# EAGLE schematic TPadTabletBattery (EAGLE 6.3)
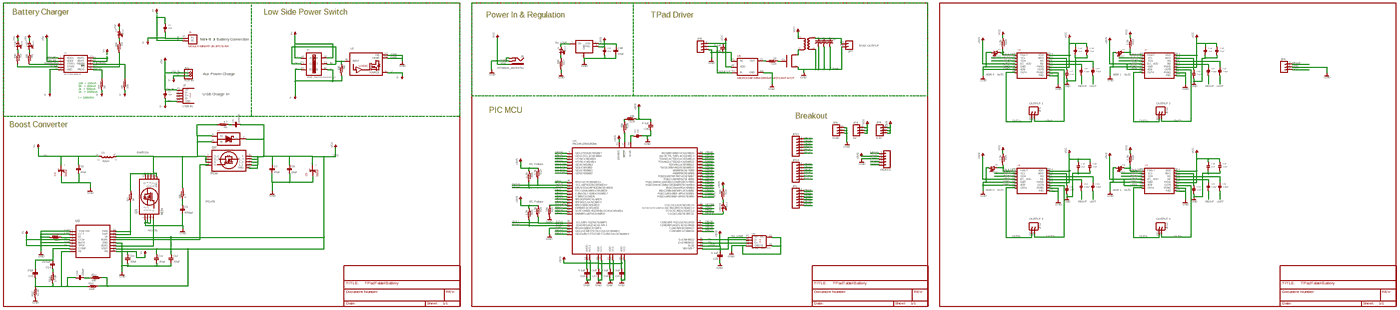
[diagram p0: schematic, sheet 1, overview]
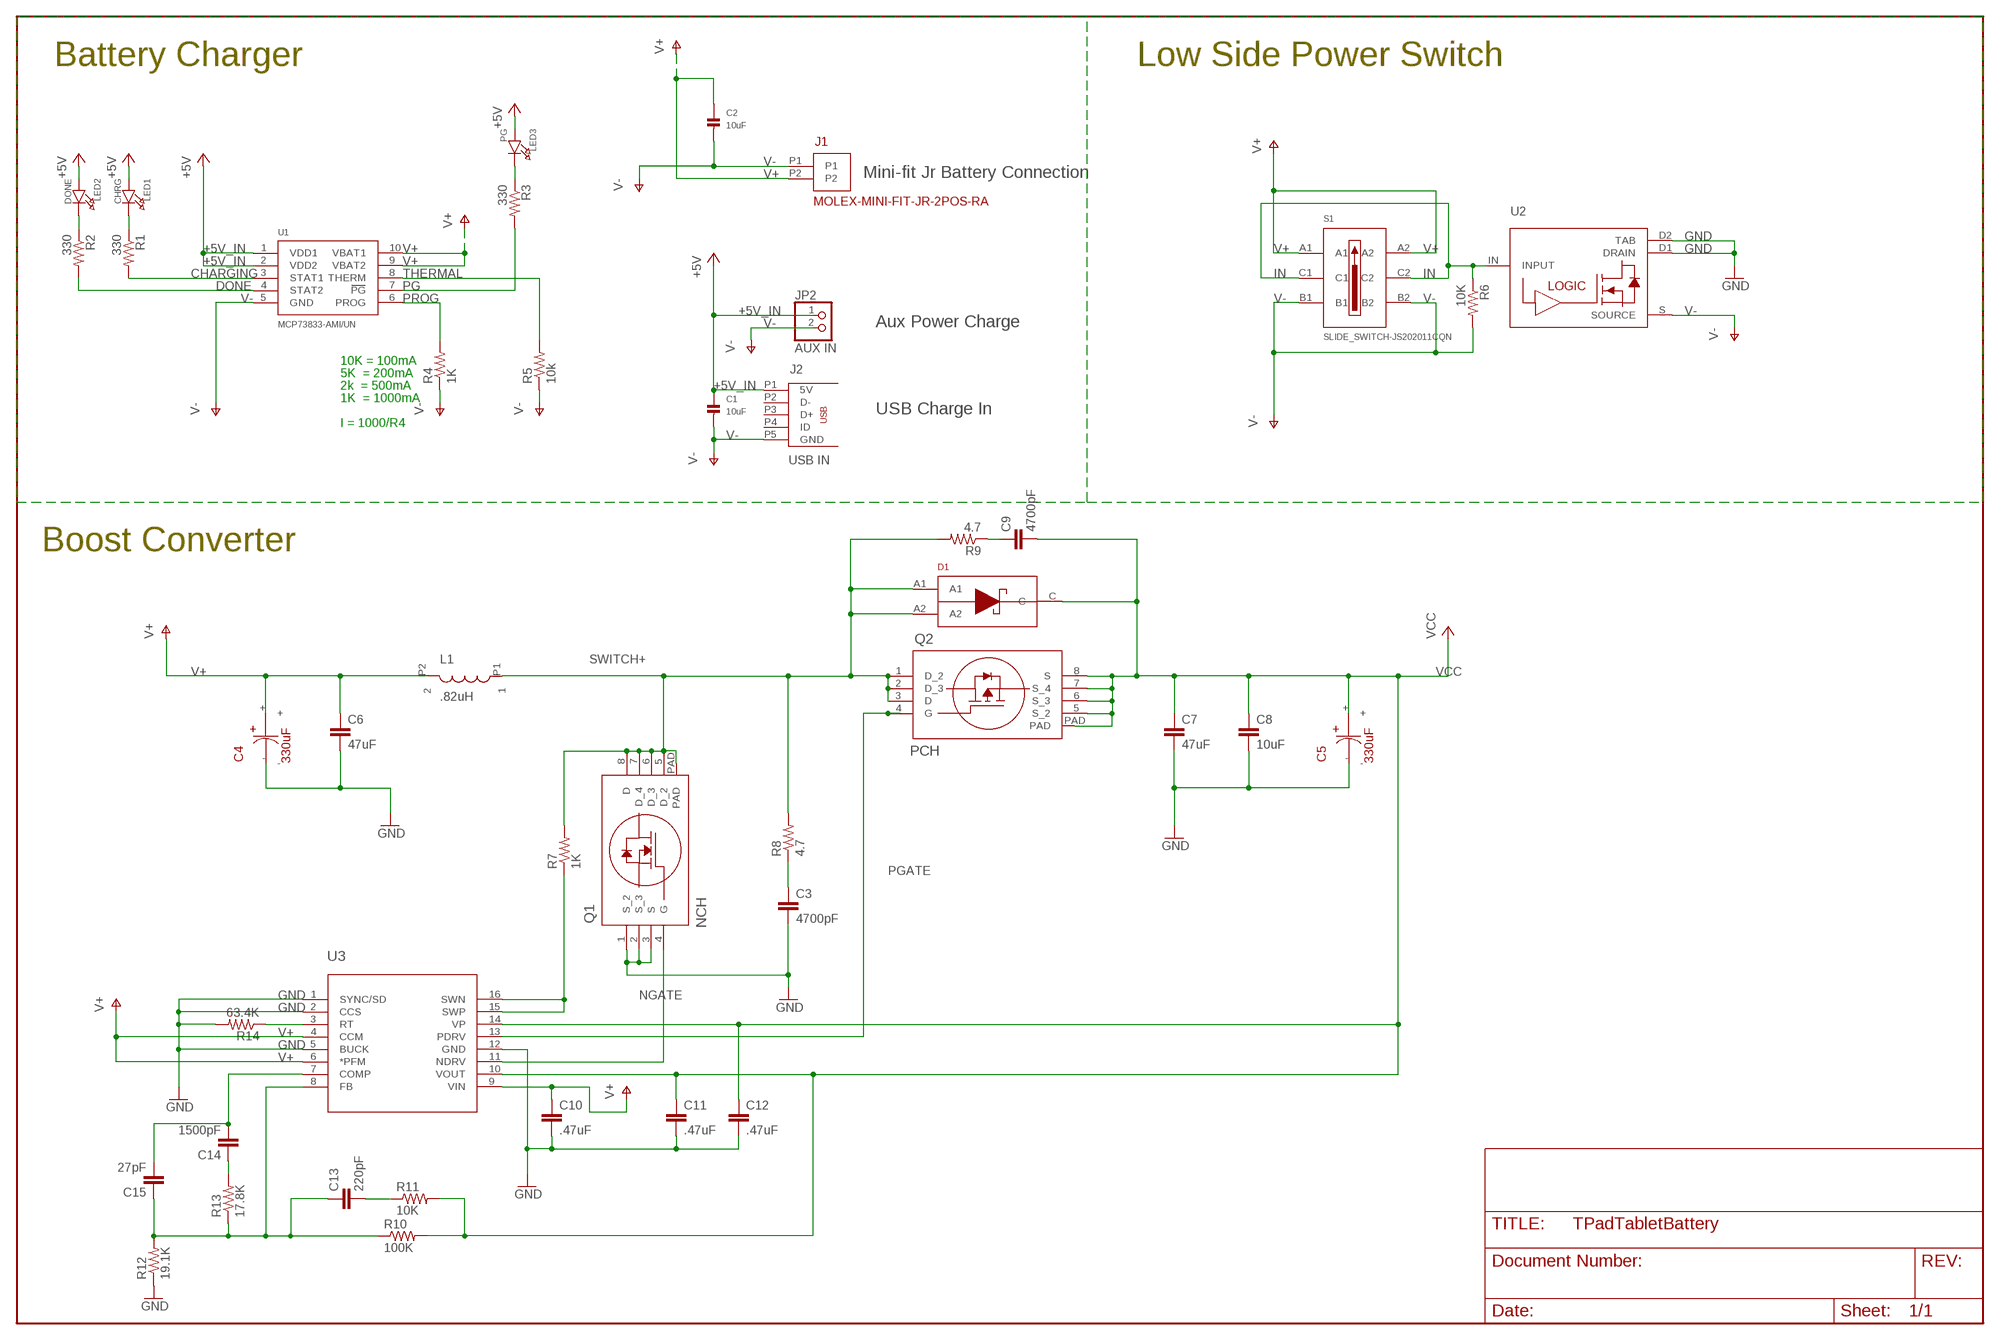
[diagram p1: schematic, sheet 1, part 1 of 4]
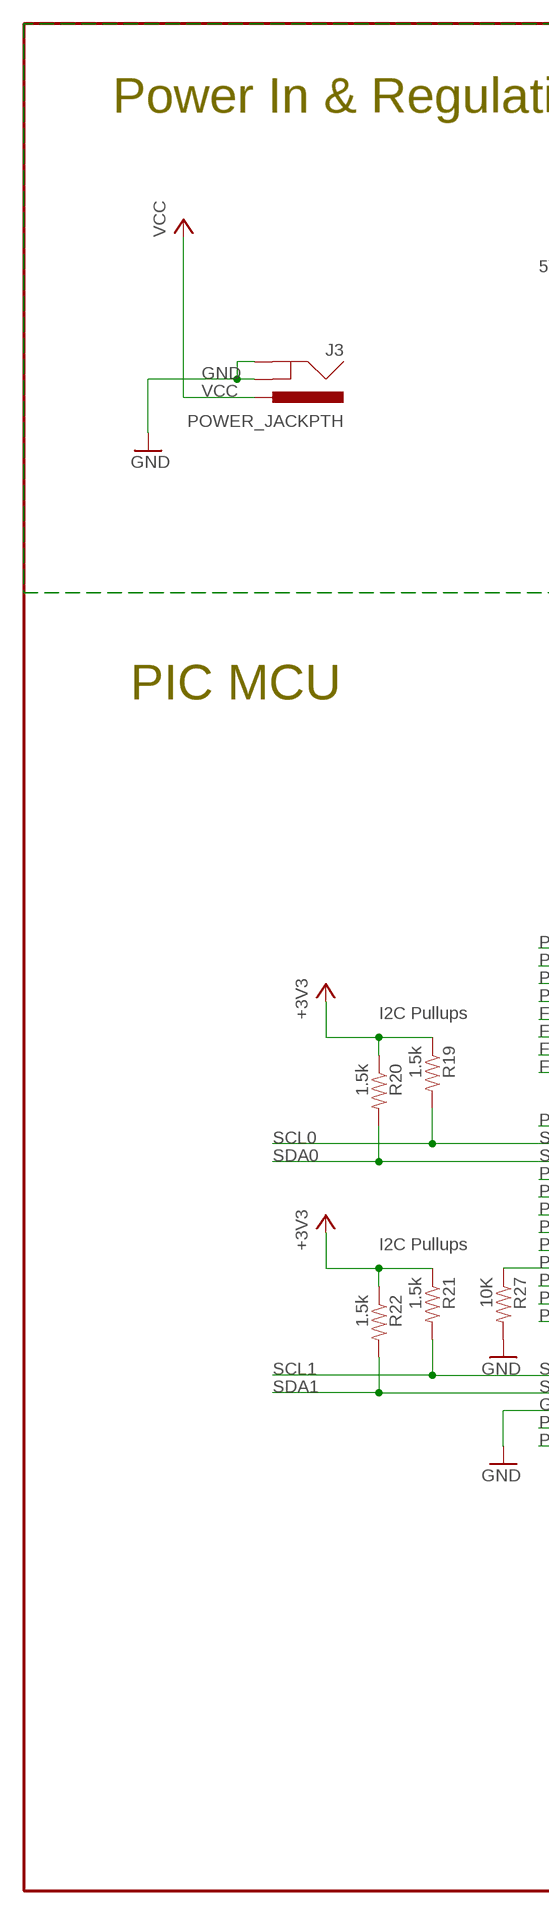
[diagram p2: schematic, sheet 1, part 2 of 4]
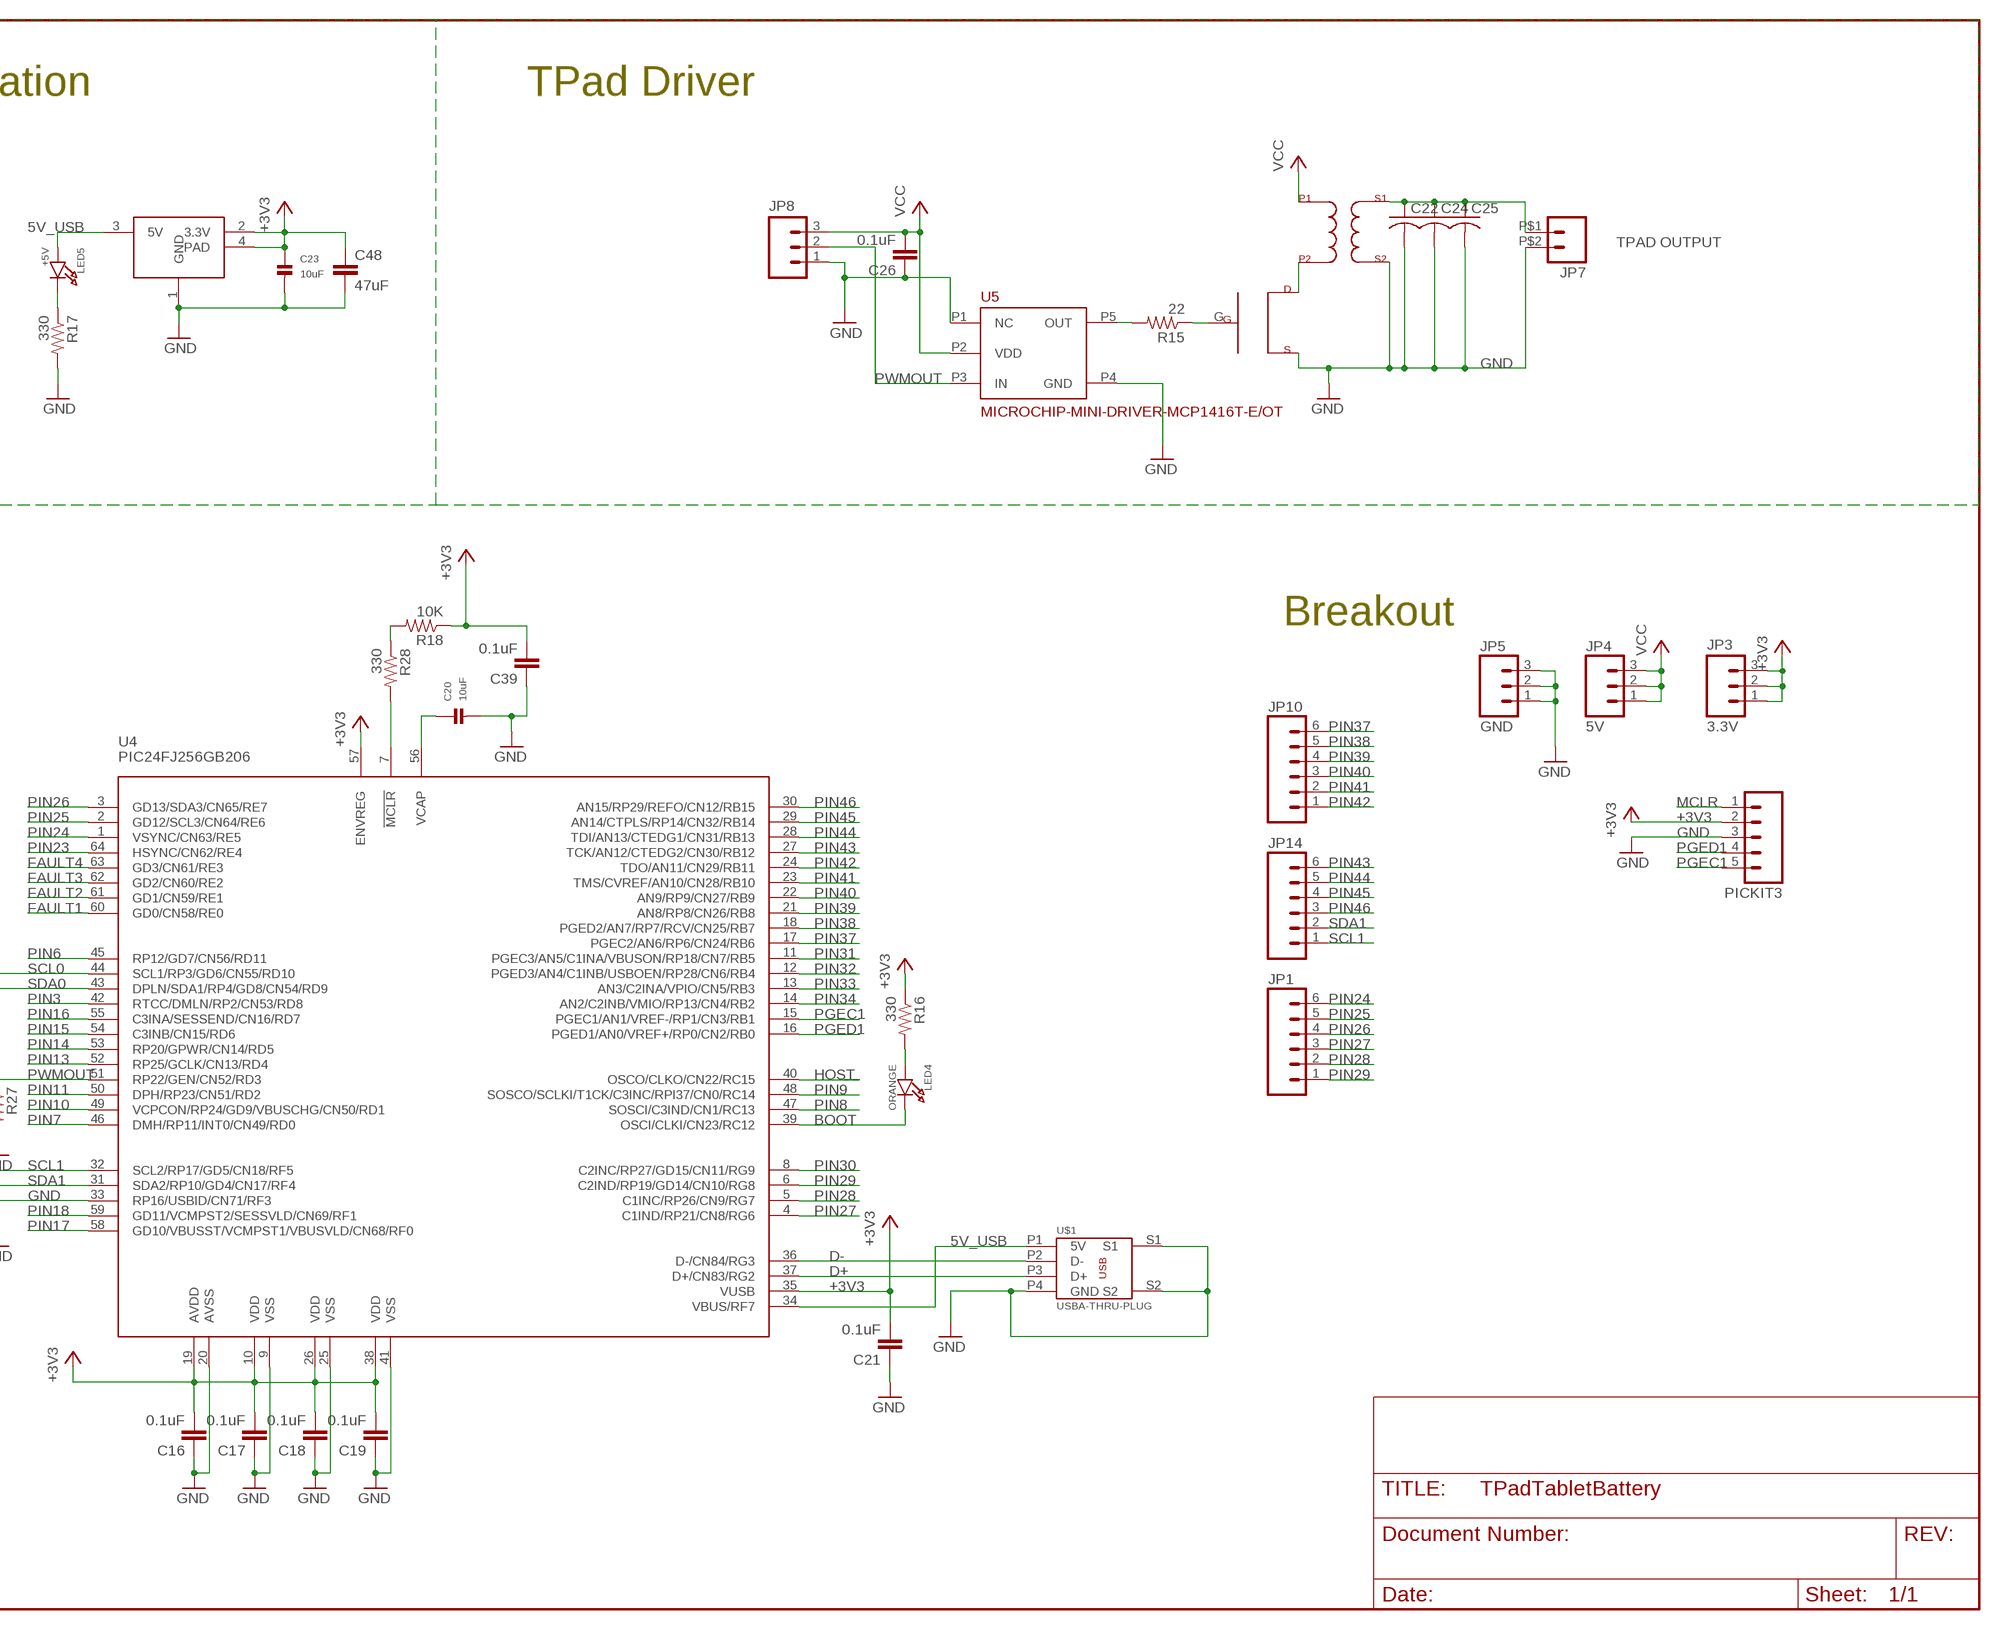
[diagram p3: schematic, sheet 1, part 3 of 4]
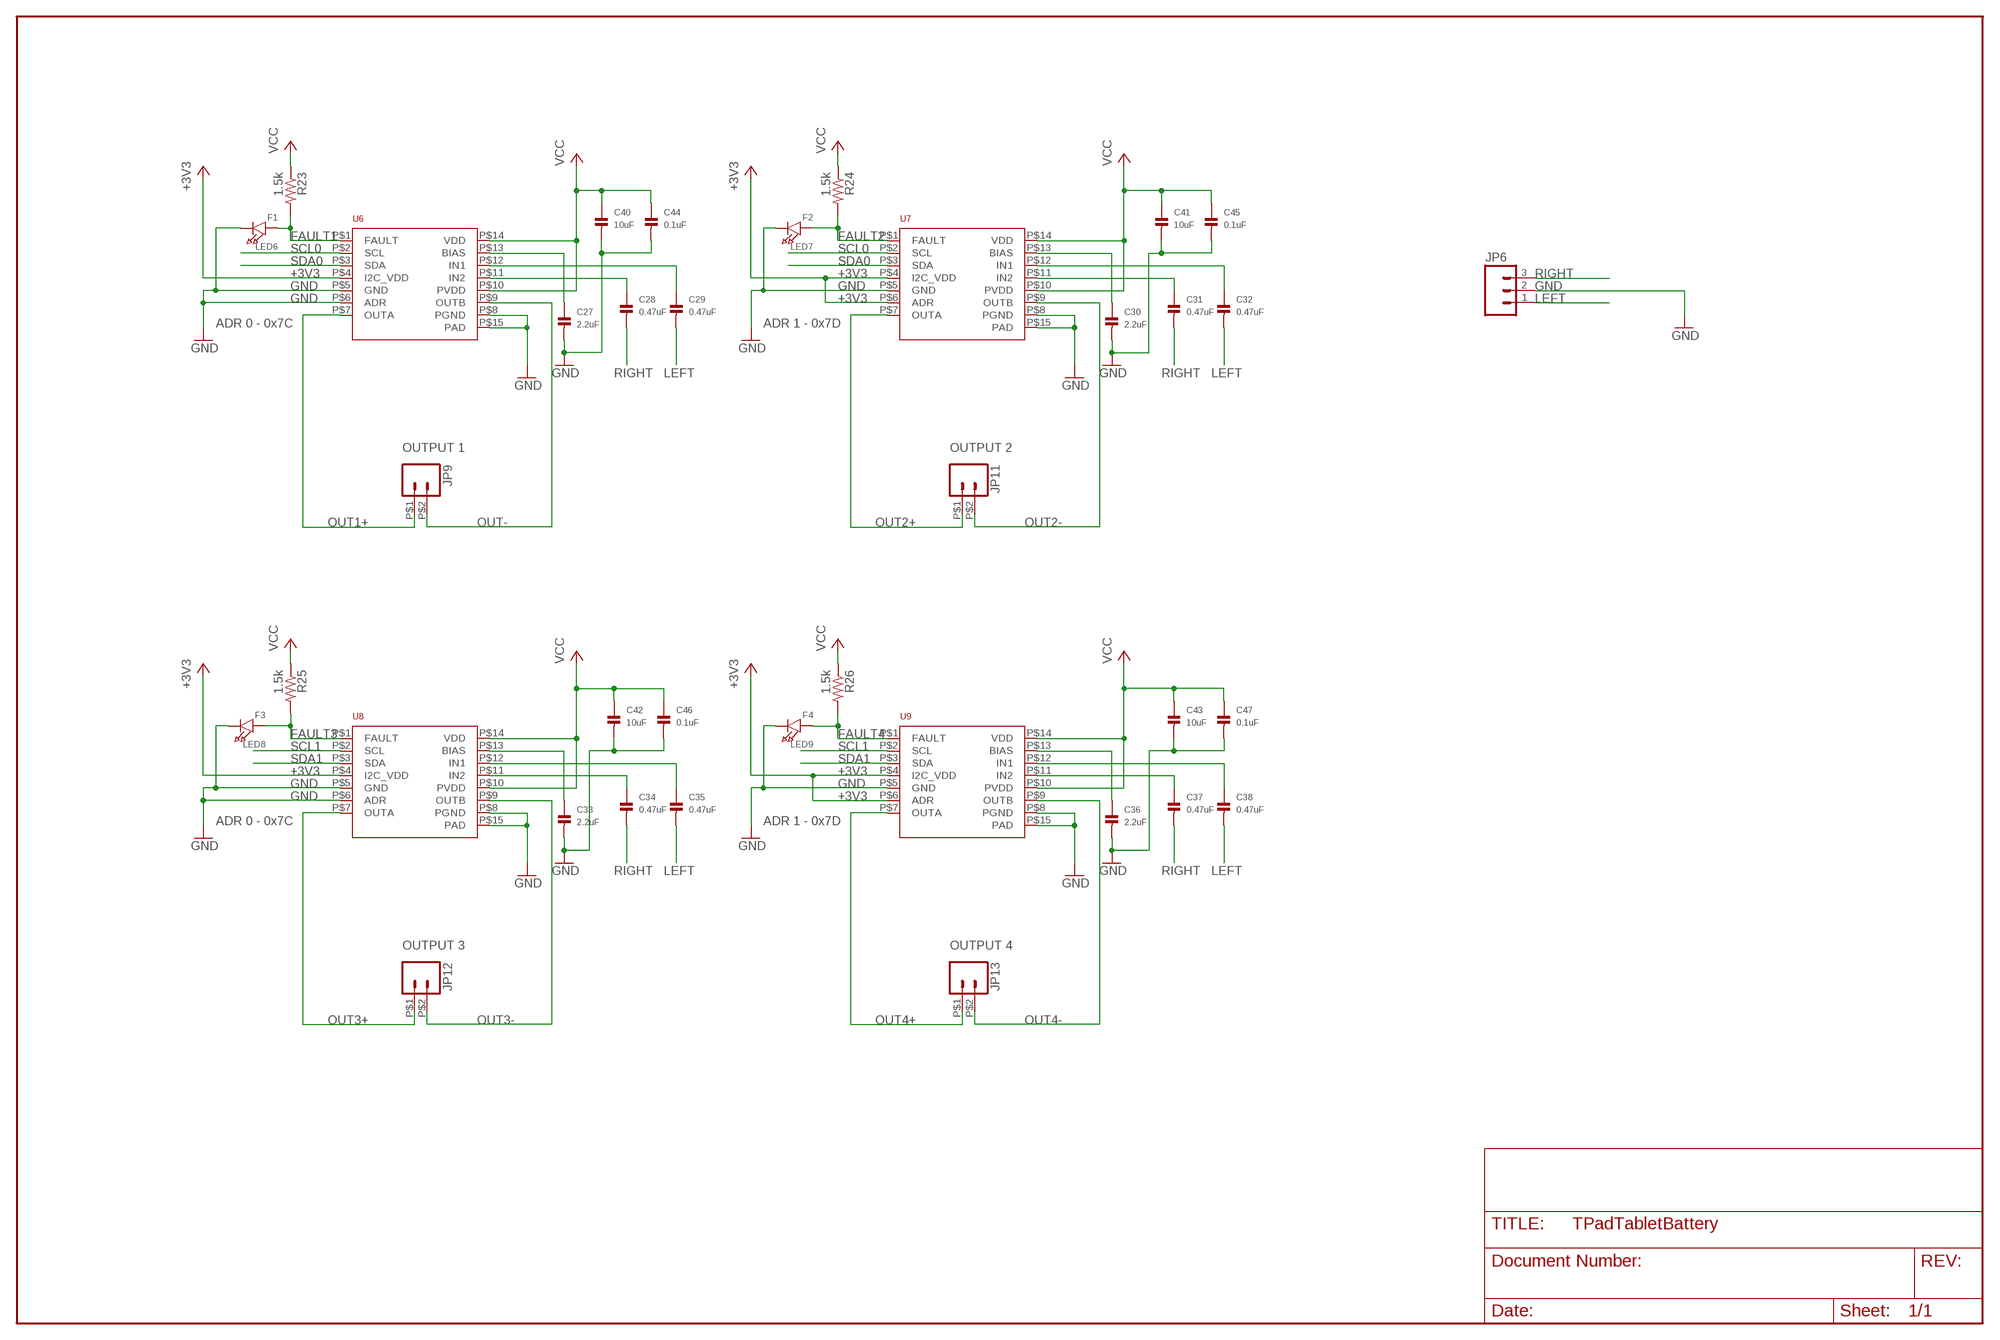
[diagram p4: schematic, sheet 1, part 4 of 4]

## Parts
C1  10uF  MICROBUILDER_CAP_CERAMIC0805  [MICROBUILDER_0805]
C2  10uF  MICROBUILDER_CAP_CERAMIC0805  [MICROBUILDER_0805]
C3  4700pF  CAP0603-CAP  [0603-CAP]
C4  330uF  330UF_POSCAP  [330UF_POSCAP]
C5  330uF  330UF_POSCAP  [330UF_POSCAP]
C6  47uF  CAP1210  [1210]
C7  47uF  CAP1210  [1210]
C8  10uF  CAP0805  [0805]
C9  4700pF  CAP0603-CAP  [0603-CAP]
C10  .47uF  CAP0603-CAP  [0603-CAP]
C11  .47uF  CAP0603-CAP  [0603-CAP]
C12  .47uF  CAP0603-CAP  [0603-CAP]
C13  220pF  CAP0603-CAP  [0603-CAP]
C14  1500pF  CAP0603-CAP  [0603-CAP]
C15  27pF  CAP0603-CAP  [0603-CAP]
C16  0.1uF  CAP0603-CAP  [0603-CAP]
C17  0.1uF  CAP0603-CAP  [0603-CAP]
C18  0.1uF  CAP0603-CAP  [0603-CAP]
C19  0.1uF  CAP0603-CAP  [0603-CAP]
C20  10uF  MICROBUILDER_CAP_CERAMIC0805  [MICROBUILDER_0805]
C21  0.1uF  CAP0603-CAP  [0603-CAP]
C22  C-US050-035X075  [C050-035X075]
C23  10uF  MICROBUILDER_CAP_CERAMIC0805  [MICROBUILDER_0805]
C24  C-US050-035X075  [C050-035X075]
C25  C-US050-035X075  [C050-035X075]
C26  0.1uF  CAP0603-CAP  [0603-CAP]
C27  2.2uF  MICROBUILDER_CAP_CERAMIC0603  [MICROBUILDER_0603]
C28  0.47uF  MICROBUILDER_CAP_CERAMIC0603  [MICROBUILDER_0603]
C29  0.47uF  MICROBUILDER_CAP_CERAMIC0603  [MICROBUILDER_0603]
C30  2.2uF  MICROBUILDER_CAP_CERAMIC0603  [MICROBUILDER_0603]
C31  0.47uF  MICROBUILDER_CAP_CERAMIC0603  [MICROBUILDER_0603]
C32  0.47uF  MICROBUILDER_CAP_CERAMIC0603  [MICROBUILDER_0603]
C33  2.2uF  MICROBUILDER_CAP_CERAMIC0603  [MICROBUILDER_0603]
C34  0.47uF  MICROBUILDER_CAP_CERAMIC0603  [MICROBUILDER_0603]
C35  0.47uF  MICROBUILDER_CAP_CERAMIC0603  [MICROBUILDER_0603]
C36  2.2uF  MICROBUILDER_CAP_CERAMIC0603  [MICROBUILDER_0603]
C37  0.47uF  MICROBUILDER_CAP_CERAMIC0603  [MICROBUILDER_0603]
C38  0.47uF  MICROBUILDER_CAP_CERAMIC0603  [MICROBUILDER_0603]
C39  0.1uF  CAP0603-CAP  [0603-CAP]
C40  10uF  MICROBUILDER_CAP_CERAMIC0805  [MICROBUILDER_0805]
C41  10uF  MICROBUILDER_CAP_CERAMIC0805  [MICROBUILDER_0805]
C42  10uF  MICROBUILDER_CAP_CERAMIC0805  [MICROBUILDER_0805]
C43  10uF  MICROBUILDER_CAP_CERAMIC0805  [MICROBUILDER_0805]
C44  0.1uF  MICROBUILDER_CAP_CERAMIC0603  [MICROBUILDER_0603]
C45  0.1uF  MICROBUILDER_CAP_CERAMIC0603  [MICROBUILDER_0603]
C46  0.1uF  MICROBUILDER_CAP_CERAMIC0603  [MICROBUILDER_0603]
C47  0.1uF  MICROBUILDER_CAP_CERAMIC0603  [MICROBUILDER_0603]
C48  47uF  CAP1210  [1210]
D1  POWER-DIODE_PDS835L  [POWER-DIODE_PDS835L]
J1  MOLEX-MINI-FIT-JR-2POS-RA  [MOLEX-MINI-FIT-JR-2POS-RA]
J2  USB IN  USBMICROB  [USBMICROBSMT]
J3  POWER_JACKPTH  [POWER_JACK_PTH]
JP1  M06SIP  [1X06]
JP2  AUX IN  MICROBUILDER_HEADER-1X2ROUND  [MICROBUILDER_1X02_ROUND]
JP3  3.3V  M03PTH  [1X03]
JP4  5V  M03PTH  [1X03]
JP5  GND  M03PTH  [1X03]
JP6  M03PTH  [1X03]
JP7  M02PTH2  [1X02_BIG]
JP8  M03PTH  [1X03]
JP9  M02PTH2  [1X02_BIG]
JP10  M06SIP  [1X06]
JP11  M02PTH2  [1X02_BIG]
JP12  M02PTH2  [1X02_BIG]
JP13  M02PTH2  [1X02_BIG]
JP14  M06SIP  [1X06]
L1  .82uH  .82UH_INDUCTOR-IHLP3232DZERR82M01  [.82UH_INDUCTOR-IHLP3232DZERR82M01]
LED1  CHRG  MICROBUILDER_LED0603  [MICROBUILDER_CHIPLED_0603]
LED2  DONE  MICROBUILDER_LED0603  [MICROBUILDER_CHIPLED_0603]
LED3  PG  MICROBUILDER_LED0603  [MICROBUILDER_CHIPLED_0603]
LED4  ORANGE  MICROBUILDER_LED0603  [MICROBUILDER_CHIPLED_0603]
LED5  +5V  MICROBUILDER_LED0603  [MICROBUILDER_CHIPLED_0603]
LED6  F1  MICROBUILDER_LED0603  [MICROBUILDER_CHIPLED_0603]
LED7  F2  MICROBUILDER_LED0603  [MICROBUILDER_CHIPLED_0603]
LED8  F3  MICROBUILDER_LED0603  [MICROBUILDER_CHIPLED_0603]
LED9  F4  MICROBUILDER_LED0603  [MICROBUILDER_CHIPLED_0603]
PICKIT3  M05PTH  [1X05]
Q1  NCH  NCH-MOSFET_CSD16340Q3  [DQG8]
Q2  PCH  PCH-MOSFET_CSD25401Q3  [DQG8]
R1  330  RESISTOR0603-RES  [0603-RES]
R2  330  RESISTOR0603-RES  [0603-RES]
R3  330  RESISTOR0603-RES  [0603-RES]
R4  1K  RESISTOR0805-RES  [0805]
R5  10k  RESISTOR0805-RES  [0805]
R6  10K  RESISTOR0603-RES  [0603-RES]
R7  1K  RESISTOR0603-RES  [0603-RES]
R8  4.7  RESISTOR0603-RES  [0603-RES]
R9  4.7  RESISTOR0603-RES  [0603-RES]
R10  100K  RESISTOR0603-RES  [0603-RES]
R11  10K  RESISTOR0603-RES  [0603-RES]
R12  19.1K  RESISTOR0603-RES  [0603-RES]
R13  17.8K  RESISTOR0603-RES  [0603-RES]
R14  63.4K  RESISTOR0603-RES  [0603-RES]
R15  22  RESISTOR0603-RES  [0603-RES]
R16  330  RESISTOR0603-RES  [0603-RES]
R17  330  RESISTOR0603-RES  [0603-RES]
R18  10K  RESISTOR0603-RES  [0603-RES]
R19  1.5k  RESISTOR0603-RES  [0603-RES]
R20  1.5k  RESISTOR0603-RES  [0603-RES]
R21  1.5k  RESISTOR0603-RES  [0603-RES]
R22  1.5k  RESISTOR0603-RES  [0603-RES]
R23  1.5k  RESISTOR0603-RES  [0603-RES]
R24  1.5k  RESISTOR0603-RES  [0603-RES]
R25  1.5k  RESISTOR0603-RES  [0603-RES]
R26  1.5k  RESISTOR0603-RES  [0603-RES]
R27  10K  RESISTOR0603-RES  [0603-RES]
R28  330  RESISTOR0603-RES  [0603-RES]
S1  SLIDE_SWITCH-JS202011CQN  [SLIDE_SWITCH-JS202011CQN]
U1  MCP73833-AMI/UN  MICROBUILDER_MCP73833  [MICROBUILDER_MSOP10]
U2  STM-LOW-SWITCH-VNL5050N3TR-E  [SOT223]
U3  TPS43000_PW_16  [PW16]
U4  PIC24FJ256GB206  PIC24FXXXDAX06  [PIC24FXXX_TQFP64]
U5  MICROCHIP-MINI-DRIVER-MCP1416T-E/OT  [MICROCHIP-MINI-DRIVER-MCP1416T-E/OT]
U6  TI-AUDIOAMP-LM48100Q  [TI-AUDIOAMP-LM48100Q]
U7  TI-AUDIOAMP-LM48100Q  [TI-AUDIOAMP-LM48100Q]
U8  TI-AUDIOAMP-LM48100Q  [TI-AUDIOAMP-LM48100Q]
U9  TI-AUDIOAMP-LM48100Q  [TI-AUDIOAMP-LM48100Q]
U$1  USBA-THRU-PLUG  [USBA-THRU-FLUG]
U$4  TRANSFORMER  [TRANSFORMER]
U$5  TPAD_IRF520N  [TPAD_TO220]
U$6  LD33V  [SOT223]

## Nets
5V_USB: LED5.A U4.34(VBUS/RF7) U$1.P1(5V) U$6.3(5V)
+3V3: C16.2 C17.2 C18.2 C19.2 C21.2 C23.1 C39.2 C48.1 JP3.1 JP3.2 JP3.3 PICKIT3.2 R16.1 R18.1 R19.1 R20.1 R21.1 R22.1 U4.10(VDD) U4.19(AVDD) U4.26(VDD) U4.35(VUSB) U4.38(VDD) U4.57(ENVREG) U6.P$4(I2C_VDD) U7.P$4(I2C_VDD) U7.P$6(ADR) U8.P$4(I2C_VDD) U9.P$4(I2C_VDD) U9.P$6(ADR) U$6.2(3.3V) U$6.4(PAD)
+5V_IN: C1.1 J2.P1(5V) JP2.1 LED1.A LED2.A LED3.A U1.1(VDD1) U1.2(VDD2) ; supply symbol labelled +5V
BOOT: LED4.C U4.39(OSCI/CLKI/CN23/RC12)
CHARGING: R1.2 U1.3(STAT1)
D+: U4.37(D+/CN83/RG2) U$1.P3(D+)
D-: U4.36(D-/CN84/RG3) U$1.P2(D-)
DONE: R2.2 U1.4(STAT2)
FAULT1: LED6.A R23.2 U4.60(GD0/CN58/RE0) U6.P$1(FAULT)
FAULT2: LED7.A R24.2 U4.61(GD1/CN59/RE1) U7.P$1(FAULT)
FAULT3: LED8.A R25.2 U4.62(GD2/CN60/RE2) U8.P$1(FAULT)
FAULT4: LED9.A R26.2 U4.63(GD3/CN61/RE3) U9.P$1(FAULT)
GND: C3.2 C4.- C5.- C6.2 C7.2 C8.2 C10.2 C11.2 C12.2 C16.1 C17.1 C18.1 C19.1 C20.2 C21.1 C22.2 C23.2 C24.2 C25.2 C26.1 C27.2 C30.2 C33.2 C36.2 C39.1 C40.2 C41.2 C42.2 C43.2 C44.2 C45.2 C46.2 C47.2 C48.2 J3.GND J3.GNDBREAK JP5.1 JP5.2 JP5.3 JP6.2 JP7.P$2 JP8.1 LED6.C LED7.C LED8.C LED9.C PICKIT3.3 Q1.1(S_2) Q1.2(S_3) Q1.3(S) R12.1 R14.2 R17.2 R27.2 U2.D1(DRAIN) U2.D2(TAB) U3.1(SYNC/SD) U3.2(CCS) U3.5(BUCK) U3.12(GND) U4.9(VSS) U4.20(AVSS) U4.25(VSS) U4.33(RP16/USBID/CN71/RF3) U4.41(VSS) U5.P1(NC) U5.P4(GND) U6.P$5(GND) U6.P$6(ADR) U6.P$8(PGND) U6.P$15(PAD) U7.P$5(GND) U7.P$8(PGND) U7.P$15(PAD) U8.P$5(GND) U8.P$6(ADR) U8.P$8(PGND) U8.P$15(PAD) U9.P$5(GND) U9.P$8(PGND) U9.P$15(PAD) U$1.P4(GND) U$1.S1 U$1.S2 U$4.S2 U$5.S U$6.1(GND)
HOST: U4.40(OSCO/CLKO/CN22/RC15)
IN: R6.1 S1.C1 S1.C2 U2.IN(INPUT)
LEFT: C29.2 C32.2 C35.2 C38.2 JP6.1
MCLR: PICKIT3.1 R18.2 R28.1
N$2: R7.1 U3.15(SWP) U3.16(SWN)
N$3: LED2.C R2.1
N$4: LED1.C R1.1
N$5: LED3.C R3.1
N$6: R28.2 U4.7(!MCLR)
N$7: C9.1 R9.1
N$8: C13.1 C15.1 R10.1 R12.2 R13.1 U3.8(FB)
N$11: C14.2 C15.2 U3.7(COMP)
N$12: C3.1 R8.1
N$13: C20.1 U4.56(VCAP)
N$14: R14.1 U3.3(RT)
N$15: C14.1 R13.2
N$16: LED4.A R16.2
N$17: C13.2 R11.1
N$18: U$4.P2 U$5.D
N$19: R15.2 U5.P5(OUT)
N$20: C22.1 C24.1 C25.1 JP7.P$1 U$4.S1
N$21: LED5.C R17.1
N$23: R15.1 U$5.G
N$24: C27.1 U6.P$13(BIAS)
N$25: C29.1 U6.P$12(IN1)
N$26: C28.1 U6.P$11(IN2)
N$27: C30.1 U7.P$13(BIAS)
N$28: C32.1 U7.P$12(IN1)
N$29: C31.1 U7.P$11(IN2)
N$30: C33.1 U8.P$13(BIAS)
N$31: C35.1 U8.P$12(IN1)
N$32: C34.1 U8.P$11(IN2)
N$33: C36.1 U9.P$13(BIAS)
N$34: C38.1 U9.P$12(IN1)
N$35: C37.1 U9.P$11(IN2)
NGATE: Q1.4(G) U3.11(NDRV)
OUT1+: JP9.P$1 U6.P$7(OUTA)
OUT2+: JP11.P$1 U7.P$7(OUTA)
OUT2-: JP11.P$2 U7.P$9(OUTB)
OUT3+: JP12.P$1 U8.P$7(OUTA)
OUT3-: JP12.P$2 U8.P$9(OUTB)
OUT4+: JP13.P$1 U9.P$7(OUTA)
OUT4-: JP13.P$2 U9.P$9(OUTB)
OUT-: JP9.P$2 U6.P$9(OUTB)
PG: R3.2 U1.7(PG)
PGATE: Q2.4(G) U3.13(PDRV)
PGEC1: PICKIT3.5 U4.15(PGEC1/AN1/VREF-/RP1/CN3/RB1)
PGED1: PICKIT3.4 U4.16(PGED1/AN0/VREF+/RP0/CN2/RB0)
PIN3: U4.42(RTCC/DMLN/RP2/CN53/RD8)
PIN6: U4.45(RP12/GD7/CN56/RD11)
PIN7: U4.46(DMH/RP11/INT0/CN49/RD0)
PIN8: U4.47(SOSCI/C3IND/CN1/RC13)
PIN9: U4.48(SOSCO/SCLKI/T1CK/C3INC/RPI37/CN0/RC14)
PIN10: U4.49(VCPCON/RP24/GD9/VBUSCHG/CN50/RD1)
PIN11: U4.50(DPH/RP23/CN51/RD2)
PIN13: U4.52(RP25/GCLK/CN13/RD4)
PIN14: U4.53(RP20/GPWR/CN14/RD5)
PIN15: U4.54(C3INB/CN15/RD6)
PIN16: U4.55(C3INA/SESSEND/CN16/RD7)
PIN17: U4.58(GD10/VBUSST/VCMPST1/VBUSVLD/CN68/RF0)
PIN18: U4.59(GD11/VCMPST2/SESSVLD/CN69/RF1)
PIN23: U4.64(HSYNC/CN62/RE4)
PIN24: JP1.6 U4.1(VSYNC/CN63/RE5)
PIN25: JP1.5 U4.2(GD12/SCL3/CN64/RE6)
PIN26: JP1.4 U4.3(GD13/SDA3/CN65/RE7)
PIN27: JP1.3 U4.4(C1IND/RP21/CN8/RG6)
PIN28: JP1.2 U4.5(C1INC/RP26/CN9/RG7)
PIN29: JP1.1 U4.6(C2IND/RP19/GD14/CN10/RG8)
PIN30: U4.8(C2INC/RP27/GD15/CN11/RG9)
PIN31: U4.11(PGEC3/AN5/C1INA/VBUSON/RP18/CN7/RB5)
PIN32: U4.12(PGED3/AN4/C1INB/USBOEN/RP28/CN6/RB4)
PIN33: U4.13(AN3/C2INA/VPIO/CN5/RB3)
PIN34: U4.14(AN2/C2INB/VMIO/RP13/CN4/RB2)
PIN37: JP10.6 U4.17(PGEC2/AN6/RP6/CN24/RB6)
PIN38: JP10.5 U4.18(PGED2/AN7/RP7/RCV/CN25/RB7)
PIN39: JP10.4 U4.21(AN8/RP8/CN26/RB8)
PIN40: JP10.3 U4.22(AN9/RP9/CN27/RB9)
PIN41: JP10.2 U4.23(TMS/CVREF/AN10/CN28/RB10)
PIN42: JP10.1 U4.24(TDO/AN11/CN29/RB11)
PIN43: JP14.6 U4.27(TCK/AN12/CTEDG2/CN30/RB12)
PIN44: JP14.5 U4.28(TDI/AN13/CTEDG1/CN31/RB13)
PIN45: JP14.4 U4.29(AN14/CTPLS/RP14/CN32/RB14)
PIN46: JP14.3 U4.30(AN15/RP29/REFO/CN12/RB15)
PROG: R4.2 U1.6(PROG)
PWMOUT: JP8.2 R27.1 U4.51(RP22/GEN/CN52/RD3) U5.P3(IN)
RIGHT: C28.2 C31.2 C34.2 C37.2 JP6.3
SCL0: R19.2 U4.44(SCL1/RP3/GD6/CN55/RD10) U6.P$2(SCL) U7.P$2(SCL)
SCL1: JP14.1 R21.2 U4.32(SCL2/RP17/GD5/CN18/RF5) U8.P$2(SCL) U9.P$2(SCL)
SDA0: R20.2 U4.43(DPLN/SDA1/RP4/GD8/CN54/RD9) U6.P$3(SDA) U7.P$3(SDA)
SDA1: JP14.2 R22.2 U4.31(SDA2/RP10/GD4/CN17/RF4) U8.P$3(SDA) U9.P$3(SDA)
SWITCH+: D1.A1 D1.A2 L1.P1 Q1.5(D_2) Q1.6(D_3) Q1.7(D_4) Q1.8(D) Q1.PAD Q2.1(D_2) Q2.2(D_3) Q2.3(D) R7.2 R8.2 R9.2
THERMAL: R5.2 U1.8(THERM)
V+: C2.1 C4.+ C6.1 C10.1 J1.P2 L1.P2 S1.A1 S1.A2 U1.9(VBAT2) U1.10(VBAT1) U3.4(CCM) U3.6(*PFM) U3.9(VIN)
V-: C1.2 C2.2 J1.P1 J2.P5(GND) JP2.2 R4.1 R5.1 R6.2 S1.B1 S1.B2 U1.5(GND) U2.S(SOURCE)
VCC: C5.+ C7.1 C8.1 C9.2 C11.1 C12.1 C26.2 C40.1 C41.1 C42.1 C43.1 C44.1 C45.1 C46.1 C47.1 D1.C J3.PWR JP4.1 JP4.2 JP4.3 JP8.3 Q2.5(S_2) Q2.6(S_3) Q2.7(S_4) Q2.8(S) Q2.PAD R10.2 R11.2 R23.1 R24.1 R25.1 R26.1 U3.10(VOUT) U3.14(VP) U5.P2(VDD) U6.P$10(PVDD) U6.P$14(VDD) U7.P$10(PVDD) U7.P$14(VDD) U8.P$10(PVDD) U8.P$14(VDD) U9.P$10(PVDD) U9.P$14(VDD) U$4.P1
Unconnected: J2.P2(D-) J2.P3(D+) J2.P4(ID)

## Notes on the sheet
- Battery Charger | Low Side Power Switch
- Power In & Regulation | TPad Driver
- Mini-fit Jr Battery Connection
- TPAD OUTPUT
- Aux Power Charge | ADR 0 - 0x7C | ADR 1 - 0x7D
- 10K = 100mA
- 5K  = 200mA
- 2k  = 500mA
- 1K  = 1000mA
- USB Charge In
- I = 1000/R4
- OUTPUT 1 | OUTPUT 2
- PIC MCU
- Breakout
- Boost Converter
- I2C Pullups
- ADR 0 - 0x7C | ADR 1 - 0x7D
- I2C Pullups
- OUTPUT 3 | OUTPUT 4

## Library data of the parts
C1 C2 C20 C23 C27-C38 C40-C47 = MCP73833_QFN_v1.0:MICROBUILDER_CAP_CERAMIC: Ceramic Capacitors 0402 - 0402 Surface Mount Capacitors 16pF 50V 5% [Digikey: 445-4899-2-ND] 18pF 50V 5% [Digikey: 490-1281-2-ND] 22pF 50V 5% [Digikey: 490-1283-2-ND] 68pF 50V 5% [Digikey: 490-1289-2-ND] 0.1uF 10V 10% [Digikey: 490-1318-2-ND] 1.0uF 6.3V 10% [Digikey: 490-1320-2-ND] 0603 - 0603 Surface Mount Capacitors 16 pF 50V 5% [Digikey: 445-5051-2-ND] 22 pF 50V [Digikey: PCC220ACVTR-ND] 33 pF 50V 5% [Digikey: 490-1415-1-ND] 56pF 50V 5% [Digikey: 490-1421-1-ND] 220pF 50V 5% [Digikey: 445-1285-1-ND] 680 pF 50V 2200 pF 50V 5% C0G [Digikey: 445-1297-1-ND] 5600 pF 100V 5% X7R [Digikey: 478-3711-1-ND] 0.1 µF 25V 10% [Digikey: PCC2277TR-ND] 0.22 µF 16V 10% X7R [Digikey: 445-1318-1-ND] 1.0 µF 25V 10% [Digikey: 445-5146-2-ND] 0603 - RF Specific 3pF 250V +/-0.1pF RF [Digikey: 712-1347-1-ND] 18 pF 250V 5% [Digikey: 478-3505-1-ND or 712-1322-1-ND] 56 pF 250V 5% C0G RF [Digikey: 490-4867-1-ND] 68 pF 250V RF [Digikey: 490-4868-1-ND] 0805 - 0805 Surface Mount Capacitors 220 pF 250V 2% RF Ceramic Capacitor [Digikey: 712-1398-1-ND] 1000 pF 50V 2% NP0 Ceramic Capacitor [Digikey: 478-3760-1-ND] 0.1 µF 25V 10% Ceramic Capacitor [Digikey: PCC1828TR-ND] 1.0 µF 16V 10% Ceramic Capacitor[Digikey: 490-1691-2-ND] 10.0 µF 10V 10% Ceramic Capacitor[Digikey: 709-1228-1-ND] 10.0 uF 16V 10% Ceramic Capacitor [Digikey: 478-5165-2-ND] 47 uF 6.3V 20% Ceramic Capacitor [Digikey: 399-5506-1-ND] 1206 - 1206 Surface Mount Capacitors 47uF 10V 20% Ceramic Capacitor [Digikey: 399-5508-1-ND]
C3 C6-C19 C21 C26 C39 C48 = SparkFun-Capacitors:CAP: Capacitor Standard 0603 ceramic capacitor, and 0.1" leaded capacitor.
C4 C5 = Craig:330UF_POSCAP
C22 C24 C25 = rcl:C-US: CAPACITOR, American symbol
D1 = Craig:POWER-DIODE_PDS835L
J1 = Craig:MOLEX-MINI-FIT-JR-2POS-RA
J2 = Craig:USBMICROB
J3 = SparkFun-Connectors:POWER_JACK: Power Jack This is the standard 5.5mm barrel jack for power. The PTH is the most common, proven, reliable, footprint. The Slot footprint only works if the mill layer is transmitted to the PCB fab house so be warned. Spark Fun Electronics SKU : PRT-00119 SMT: CONN-08106 Mating wall wart : TOL-00298 (and others)
JP1 JP10 JP14 = SparkFun-Connectors:M06: Header 6 Standard 6-pin 0.1" header. Use with straight break away headers (SKU : PRT-00116), right angle break away headers (PRT-00553), swiss pins (PRT-00743), machine pins (PRT-00117), and female headers (PRT-00115). Molex polarized connector foot print use with SKU : PRT-08094 with associated crimp pins and housings. NOTES ON THE VARIANTS LOCK and LOCK_LONGPADS... This footprint was designed to help hold the alignment of a through-hole component (i.e. 6-pin header) while soldering it into place. You may notice that each hole has been shifted either up or down by 0.005 of an inch from it's more standard position (which is a perfectly straight line). This slight alteration caused the pins (the squares in the middle) to touch the edges of the holes. Because they are alternating, it causes a "brace" to hold the component in place. 0.005 has proven to be the perfect amount of "off-center" position when using our standard breakaway headers. Although looks a little odd when you look at the bare footprint, once you have a header in there, the alteration is very hard to notice. Also, if you push a header all the way into place, it is covered up entirely on the bottom side. This idea of altering the position of holes to aid alignment will be further integrated into the Sparkfun Library for other footprints. It can help hold any component with 3 or more connection pins.
JP2 = MCP73833_QFN_v1.0:MICROBUILDER_HEADER-1X2: PIN HEADER
JP3-JP6 JP8 = SparkFun:M03: Header 3 Standard 3-pin 0.1" header. Use with straight break away headers (SKU : PRT-00116), right angle break away headers (PRT-00553), swiss pins (PRT-00743), machine pins (PRT-00117), and female headers (PRT-00115). Molex polarized connector foot print use with SKU : PRT-08232 with associated crimp pins and housings.
JP7 JP9 JP11-JP13 = SparkFun-Connectors:M02: Header 2 Standard 2-pin 0.1" header. Use with straight break away headers (SKU : PRT-00116), right angle break away headers (PRT-00553), swiss pins (PRT-00743), machine pins (PRT-00117), and female headers (PRT-00115). Molex polarized connector foot print use with SKU : PRT-08233 with associated crimp pins and housings.
L1 = Craig:.82UH_INDUCTOR-IHLP3232DZERR82M01
LED1-LED9 = MCP73833_QFN_v1.0:MICROBUILDER_LED: LED 0603 - 0603 Surface Mount Package 2mA: Green LED - Low Power (3.9mcd, 2ma, 1.7Vf) - Digikey: 475-2709-2-ND Orange LED - Low Power (9.8mcd, 2ma, 1.8Vf) - Digikey: 475-1194-2-ND Red LED - Low Power (5mcd, 2ma, 1.8Vf) - Digikey: 475-1195-2-ND Yellow LED - Low Power (7mcd, 2ma, 1.8Vf) - Digikey: 475-1196-2-ND 5mA: Blue LED - Low Power (17mcd, 5ma, 2.9Vf) - Digikey: LNJ937W8CRACT-ND 0805 - 0805 Surface Mount Package 2mA: Red LED (8.8mcd, 2mA, 1.8Vf, Clear) - Low Power [Digikey: 475-2510-1-ND] Green LED (5mcd, 2mA, 1.8Vf, Clear) - Low Power [Digikey: 475-2730-1-ND] Yellow LED (11.3mcd, 2mA, 1.8Vf, Clear) - Low Power [Digikey: 475-2555-1-ND] 20mA: Red LED (104mcd, 20mA, Diffused) - LS R976 [Digikey: 475-1278-6-ND] Red LED (12mcd, 20mA, 2.0Vf, Clear) - APT2012EC [Digikey: 754-1128-1-ND] Green LED (15mcd, 20mA, 2.2Vf, Clear) - APT2012GC [Digikey: 754-1131-1-ND] Orange LED (160mcd, 20mA, 2.1Vf, Clear) - APT2012SECK [Digikey: 754-1130-1-ND] 1206 - 1206 Surface Mount Package Green LED (26mcd, 20mA, Diffused) - LG N971 [Digikey: 475-1407-6-ND] Red LED (15mcd, 20mA, Diffused) - LH N974 [Digikey: 475-1416-6-ND]
PICKIT3 = SparkFun:M05: Header 5 Standard 5-pin 0.1" header. Use with straight break away headers (SKU : PRT-00116), right angle break away headers (PRT-00553), swiss pins (PRT-00743), machine pins (PRT-00117), and female headers (PRT-00115). Molex polarized connector foot print use with SKU : PRT-08230 with associated crimp pins and housings.
Q1 = Craig:NCH-MOSFET_CSD16340Q3; DATASHEETURL: http://www.ti.com/lit/gpn/CSD16340Q3; DESCRIPTION: N Channel NexFET Power MOSFET; FAMILY_NAME: N-Channel MOSFET Transistors; GENERIC_PART_NUMBER: CSD16340Q3; INDUSTRY_STD_PKG_TYPE: SON; MANUFACTURER: Texas Instruments; PACKAGE_DESIGNATOR: DQG; PIN_COUNT: 8
Q2 = Craig:PCH-MOSFET_CSD25401Q3; DATASHEETURL: http://www.ti.com/lit/gpn/CSD25401Q3; DESCRIPTION: P-Channel NexFET&#153 Power MOSFET; FAMILY_NAME: P-Channel MOSFET Transistors; GENERIC_PART_NUMBER: CSD25401Q3; INDUSTRY_STD_PKG_TYPE: SON; MANUFACTURER: Texas Instruments; PACKAGE_DESIGNATOR: DQG; PIN_COUNT: 8
R1-R28 = SparkFun-Passives:RESISTOR: Resistor Basic schematic elements and footprints for 0603, 1206, and PTH resistors.
S1 = Craig:SLIDE_SWITCH-JS202011CQN
U1 = MCP73833_QFN_v1.0:MICROBUILDER_MCP73833: Lithium-Polymer/Lithium-Ion Battery Charger [Part No.] Microchip MCP73833 MSOP10 (tube only): Digikey: MCP73833T-AMI/UN or MCP73833-FCI/UN-ND Mouser: 579-MCP73833-AMI/UN DFN10 (tape): Digikey: Note Chips ending in AMI' have no timer, and chips ending in FCI have a 6-hour timer that will end the charge sequence after 6 horus regqrdless of current charge level. '
U2 = Craig:STM-LOW-SWITCH-VNL5050N3TR-E
U3 = Craig:TPS43000_PW_16; DATASHEETURL: http://www.ti.com/lit/gpn/TPS43000; DESCRIPTION: Multi-Topology (buck, boost, sepic) High Frequency DC/DC Controller; FAMILY_NAME: BUCK-BOOST, INVERTING SWITCHING CONTROLLER; GENERIC_PART_NUMBER: TPS43000; INDUSTRY_STD_PKG_TYPE: TSSOP; MANUFACTURER: Texas Instruments; MANUFACTURER_PART_NUMBER: tps43000_pw_16; PACKAGE_DESIGNATOR: PW; PIN_COUNT: 16; VENDOR: Texas Instruments
U4 = SparkFun-DigitalIC:PIC24FXXXDAX06: PIC24FXXXDAX06 PIC24FXXXDA106 / PIC24FXXXDA206
U5 = Craig:MICROCHIP-MINI-DRIVER-MCP1416T-E/OT
U6-U9 = Craig:TI-AUDIOAMP-LM48100Q
U$1 = Craig:USBA-THRU-PLUG
U$4 = TPaD:TRANSFORMER
U$5 = TPaD_Tablet_v1:TPAD_IRF520N
U$6 = TPaD:LD33V